# Altium project pIRfusiX_sensorBoard.PrjPcb
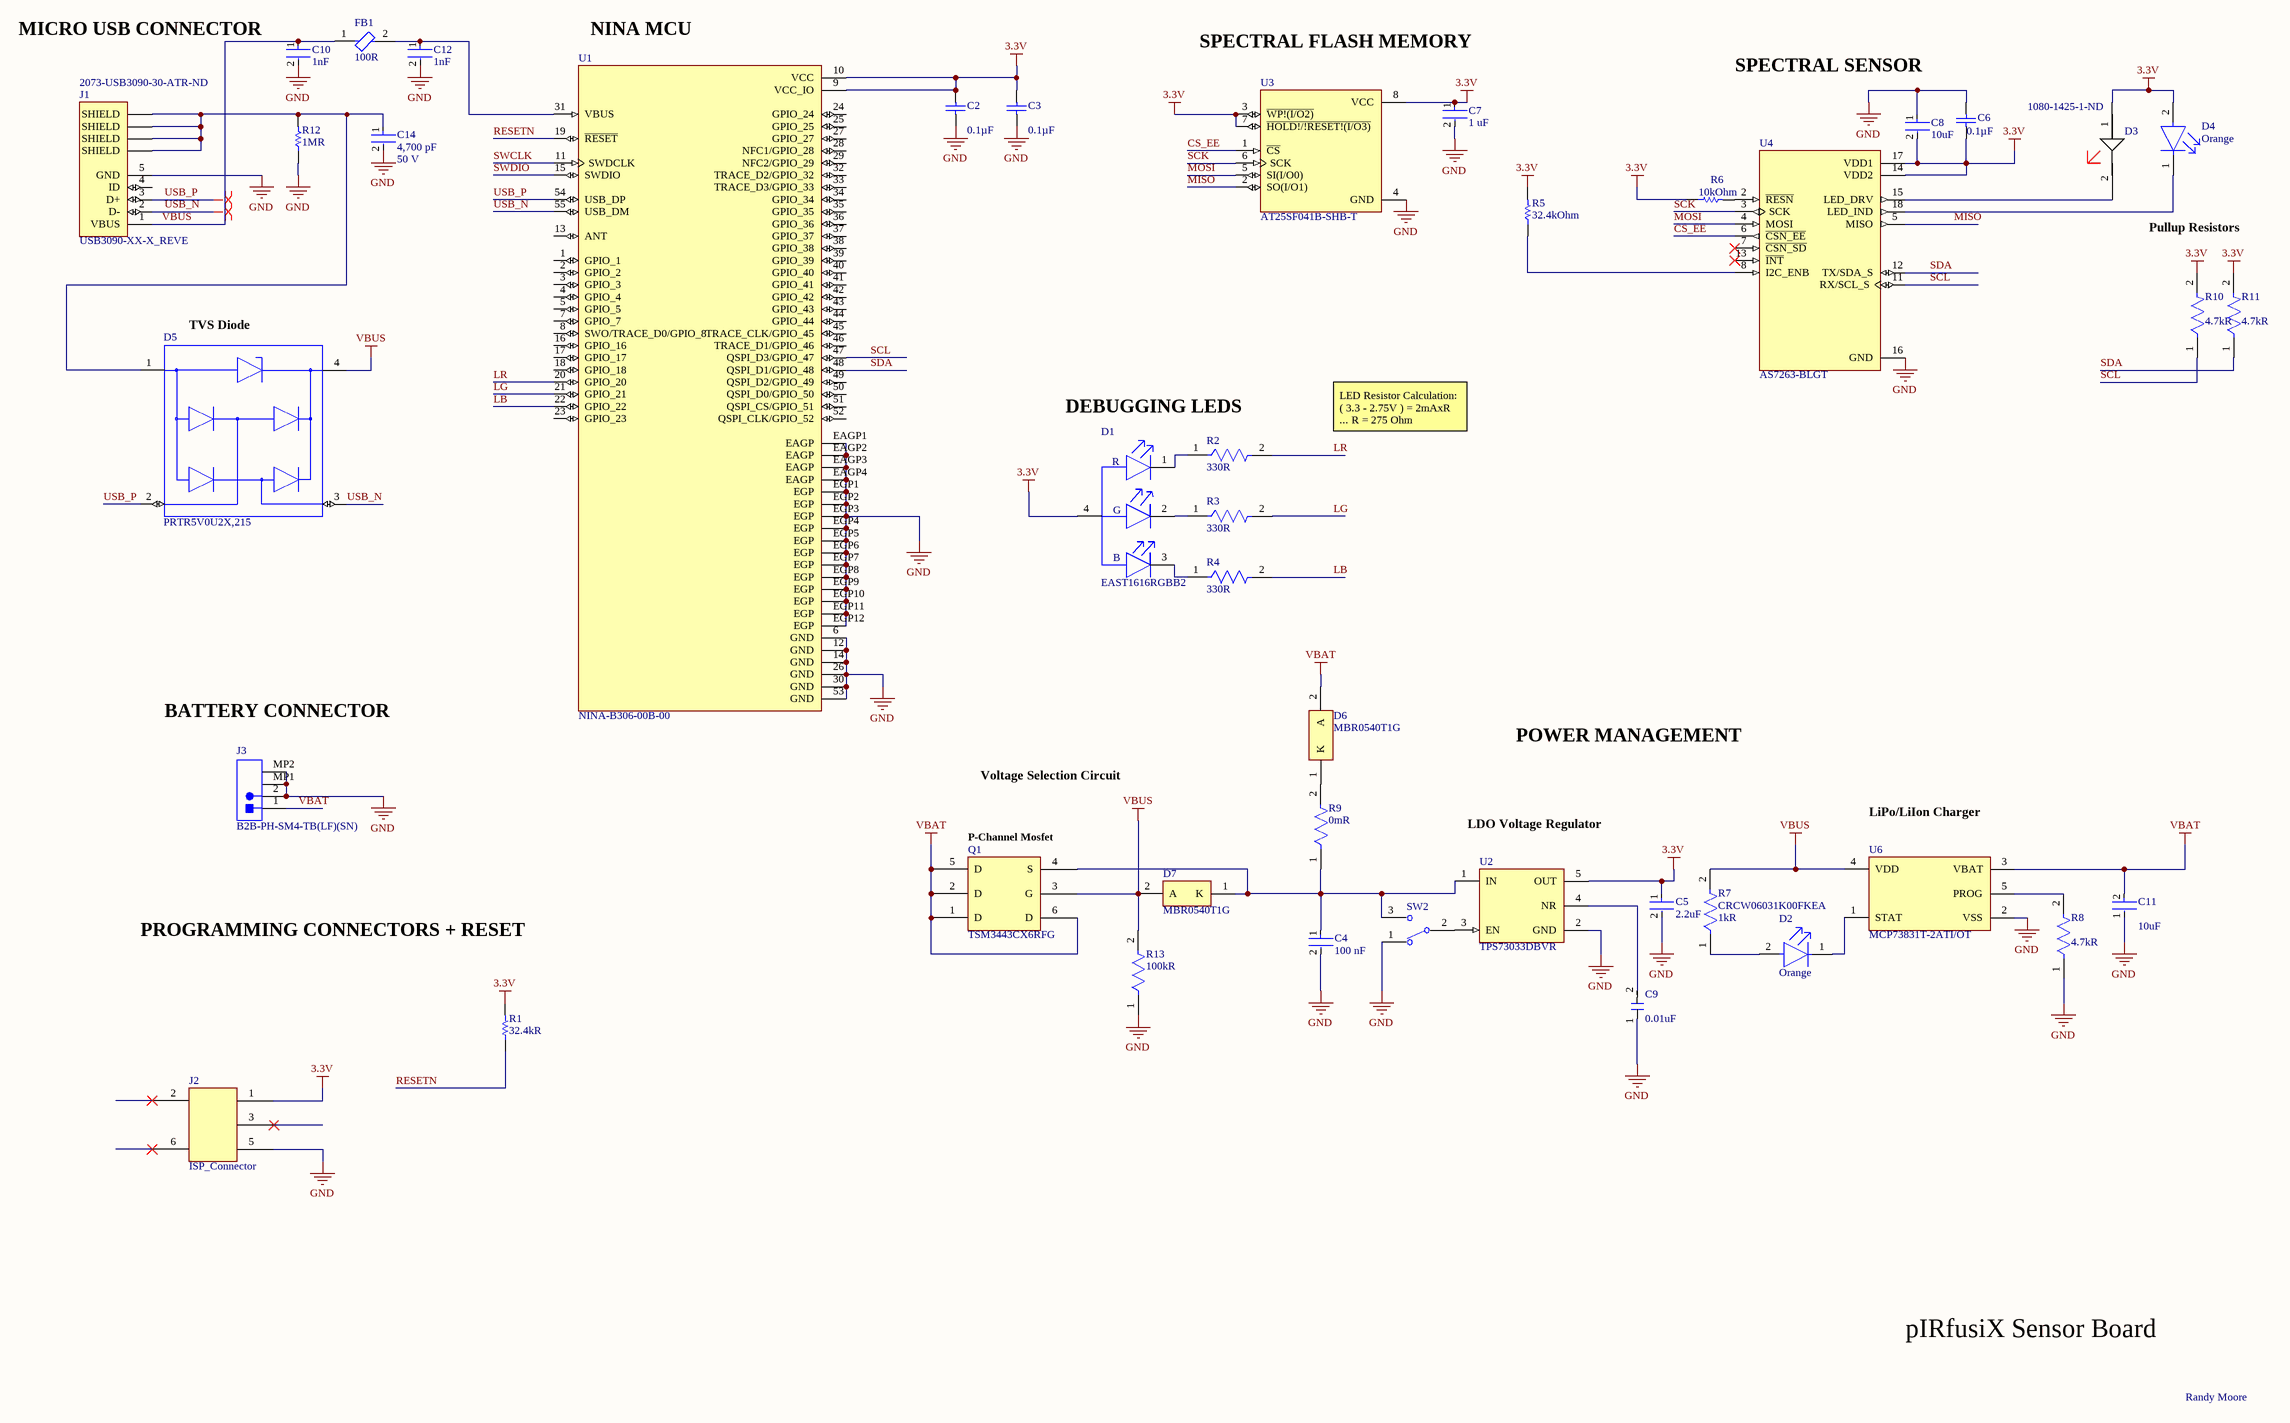
[diagram p0: SensorBoardSchm.SchDoc]
1 sheet, 43 parts. Net scope: global (net labels, ports and power ports of the same name join across sheets).
Board file: SensorBoard_PCB.PcbDoc

## Sheet SensorBoardSchm.SchDoc
size C

### Parts
C2  Capacitance: 0.1µF  [SAMS-C0603-2_M]  (hidden comment: CL10B104KB8NNNC)
C3  Capacitance: 0.1µF  [SAMS-C0603-2_M]  (hidden comment: CL10B104KB8NNNC)
C4  Capacitance: 100 nF  [FP-CC0603-DA-MFG]  (hidden comment: CC0603KRX7R7BB104)
C5  Capacitance: 2.2uF  [FP-GRM188-0_1-e0_2_0_5-MFG]  (hidden comment: GRM188R71A225KE15D)
C6  Capacitance: 0.1µF  [SAMS-C0603-2_M]  (hidden comment: CL10B104KB8NNNC)
C7  Capacitance: 1 uF  [FP-CC0603-DA-MFG]  (hidden comment: CC0603KPX7R7BB105)
C8  Capacitance: 10uF  [FP-GRM188-0_1-e0_2_0_55-IPC_A]  (hidden comment: GRM188R60J106ME47D)
C9  Capacitance: 0.01uF  [RESC1608X55N]  (hidden comment: C0603C103K3RACTU)
C10  Capacitance: 1nF  [FP-GRM188-0_1-e0_2_0_5-IPC_C]  (hidden comment: GRM1885C1H102JA01D)
C11  Capacitance: 10uF  [FP-C1608-080-0_1-MFG]  (hidden comment: C1608X5R0J106M080AB)
C12  Capacitance: 1nF  [FP-GRM188-0_1-e0_2_0_5-IPC_C]  (hidden comment: GRM1885C1H102JA01D)
C14  value 4,700 pF  Voltage Rating: 50 V  [FP-C0603C-CF-MFG]  (hidden comment: C0603C472J5GACTU)
D1  EAST1616RGBB2  [FP-EAST1616RGBB2-MFG]
D2  Colour: Orange  [FP-6_541-5056_01-4-MFG]  (hidden comment: TLMO1000-GS08)
D3  Supplier Part Number 1: 1080-1425-1-ND  [SIR19-21C/TR8]  (hidden comment: SIR19-21C/TR8)
D4  Colour: Orange  [FP-6_541-5056_01-4-MFG]  (hidden comment: TLMO1000-GS08)
D5  PRTR5V0U2X,215  [FP-SOT143B-MFG]
D6  MBR0540T1G  [ONSC-SOD-123-2-425-04_V]
D7  MBR0540T1G  [ONSC-SOD-123-2-425-04_V]
FB1  Impedance: 100R  [FP-BLM18-0_15-t0_5-MFG]  (hidden comment: BLM18EG101TN1D)
J1  USB3090-XX-X_REVE  Supplier Part Number 1: 2073-USB3090-30-ATR-ND  [GCT_USB3090-XX-X_REVE]
J2  ISP_Connector  [JST Programmer]
J3  B2B-PH-SM4-TB(LF)(SN)  [JST-B2B-PH-SM4-TB-2_V]
Q1  TSM3443CX6RFG  [SOT95P280X145-6N]
R1  Resistance: 32.4kR  [RESC1608X55X30ML15T15]  (hidden comment: ERJ-3EKF3242V)
R2  Resistance: 330R  [FP-CRCW0603-e3-MFG]  (hidden comment: CRCW0603330RFKEA)
R3  Resistance: 330R  [FP-CRCW0603-e3-MFG]  (hidden comment: CRCW0603330RFKEA)
R4  Resistance: 330R  [FP-CRCW0603-e3-MFG]  (hidden comment: CRCW0603330RFKEA)
R5  Resistance: 32.4kOhm  [RESC1608X55X30ML15T15]  (hidden comment: ERJ-3EKF3242V)
R6  Resistance: 10kOhm  [RESC1609X50X30ML10T20]  (hidden comment: CRCW060310K0FKTB)
R7  CRCW06031K00FKEA  Resistance: 1kR  [FP-CRCW0603-e3-MFG]
R8  Resistance: 4.7kR  [FP-CR0603-IPC_B]  (hidden comment: CR0603-FX-4701ELF)
R9  Resistance: 0mR  [FP-CRCW0603-HPe3-MFG]  (hidden comment: CRCW06030000Z0EAHP)
R10  Resistance: 4.7kR  [FP-CR0603-IPC_B]  (hidden comment: CR0603-FX-4701ELF)
R11  Resistance: 4.7kR  [FP-CR0603-IPC_B]  (hidden comment: CR0603-FX-4701ELF)
R12  Resistance: 1MR  [RESC1608X55X25LL10T15]  (hidden comment: RC0603FR-071ML)
R13  Resistance: 100kR  [FP-RC0603-0_55-MFG]  (hidden comment: RC0603FR-07100KL)
SW2  JS102011JAQN  [FP-JS102011JAQN-MFG]  (value not drawn)
U1  NINA-B306-00B-00  [XCVR_NINA-B306-00B-00]
U2  TPS73033DBVR  [FP-DBV0005A-MFG]
U3  AT25SF041B-SHB-T  [SOIC127P790X216-8N]
U4  AS7263-BLGT  [AS7263Footprint]
U6  MCP73831T-2ATI/OT  [FP-C04-091-OT-IPC_C]

### Nets
3.3V: C2.2 C3.2 C5.1 C6.1 C7.1 C8.2 D1.4(Common_Anode) D3.1 D4.2(A) J2.1(VDD) R1.2 R5.2 R6.1 R10.2 R11.2 U1.9(VCC_IO) U1.10(VCC) U2.5(OUT) U3.3(~{WP!(I/O2)}) U3.7(~{HOLD!/!RESET!(I/O3)}) U3.8(VCC) U4.14(VDD2) U4.17(VDD1)
GND: C2.1 C3.1 C4.2 C5.2 C6.2 C7.2 C8.1 C9.1 C10.2 C11.1 C12.2 C14.2 J1.5(GND) J2.5(GND) J3.2 J3.MP1 J3.MP2 R8.1 R12.1 R13.1 SW2.1 U1.6(GND) U1.12(GND) U1.14(GND) U1.26(GND) U1.30(GND) U1.53(GND) U1.EAGP1(EAGP) U1.EAGP2(EAGP) U1.EAGP3(EAGP) U1.EAGP4(EAGP) U1.EGP1(EGP) U1.EGP2(EGP) U1.EGP3(EGP) U1.EGP4(EGP) U1.EGP5(EGP) U1.EGP6(EGP) U1.EGP7(EGP) U1.EGP8(EGP) U1.EGP9(EGP) U1.EGP10(EGP) U1.EGP11(EGP) U1.EGP12(EGP) U2.2(GND) U3.4(GND) U4.16(GND) U6.2(VSS)
VBAT: C11.2 D6.2(A) J3.1 Q1.1(D) Q1.2(D) Q1.5(D) Q1.6(D) U6.3(VBAT)
VBUS: C10.1 D5.4(VCC) D7.2(A) FB1.1 J1.1(VBUS) Q1.3(G) R7.2 R13.2 U6.4(VDD)
CS_EE: U3.1(~{CS}) U4.6(~{CSN_EE})
LB: R4.2 U1.22(GPIO_22)
LG: R3.2 U1.21(GPIO_21)
LR: R2.2 U1.20(GPIO_20)
MISO: U3.2(SO(I/O1)) U4.5(MISO)
MOSI: U3.5(SI(I/O0)) U4.4(MOSI)
RESETN: R1.1 U1.19(~{RESET})
SCK: U3.6(SCK) U4.3(SCK)
SCL: R10.1 U1.47(QSPI_D3/GPIO_47) U4.11(RX/SCL_S)
SDA: R11.1 U1.48(QSPI_D1/GPIO_48) U4.12(TX/SDA_S)
SWCLK: U1.11(SWDCLK)
SWDIO: U1.15(SWDIO)
USB_N: D5.3(I/O_2) J1.2(D-) U1.55(USB_DM)
USB_P: D5.2(I/O_1) J1.3(D+) U1.54(USB_DP)
NetC4_1: C4.1 D7.1(K) Q1.4(S) R9.1 SW2.3 U2.1(IN)
NetC9_2: C9.2 U2.4(NR)
NetC12_1: C12.1 FB1.2 U1.31(VBUS)
NetC14_1: C14.1 D5.1(GND) J1.6(SHIELD) J1.7(SHIELD) J1.8(SHIELD) J1.9(SHIELD) R12.2
NetD1_1: D1.1(Red_C) R2.1
NetD1_2: D1.2(Green_C) R3.1
NetD1_3: D1.3(Blue_C) R4.1
NetD2_1: D2.1(C) U6.1(STAT)
NetD2_2: D2.2(A) R7.1
NetD3_2: D3.2 U4.15(LED_DRV)
NetD4_1: D4.1(C) U4.18(LED_IND)
NetD6_1: D6.1(K) R9.2
NetR5_1: R5.1 U4.8(I2C_ENB)
NetR6_2: R6.2 U4.2(~{RESN})
NetR8_2: R8.2 U6.5(PROG)
NetSW2_2: SW2.2(C) U2.3(EN)

Not connected (* = marked no-connect by the designer): J1 4(ID); J2 2(SWDIO)* 3(SWCLK)* 6(RESETN)*; U1 1(GPIO_1) 2(GPIO_2) 3(GPIO_3) 4(GPIO_4) 5(GPIO_5) 7(GPIO_7) 8(SWO/TRACE_D0/GPIO_8) 13(ANT) 16(GPIO_16) 17(GPIO_17) 18(GPIO_18) 23(GPIO_23) 24(GPIO_24) 25(GPIO_25) 27(GPIO_27) 28(NFC1/GPIO_28) 29(NFC2/GPIO_29) 32(TRACE_D2/GPIO_32) 33(TRACE_D3/GPIO_33) 34(GPIO_34) 35(GPIO_35) 36(GPIO_36) 37(GPIO_37) 38(GPIO_38) 39(GPIO_39) 40(GPIO_40) 41(GPIO_41) 42(GPIO_42) 43(GPIO_43) 44(GPIO_44) 45(TRACE_CLK/GPIO_45) 46(TRACE_D1/GPIO_46) 49(QSPI_D2/GPIO_49) 50(QSPI_D0/GPIO_50) 51(QSPI_CS/GPIO_51) 52(QSPI_CLK/GPIO_52); U4 7(~{CSN_SD})* 13(~{INT})*

### Layout directives
differential pair: USB_N, USB_P

### Notes on the sheet
- MICRO USB CONNECTOR
- (near U1) NINA MCU
- SPECTRAL FLASH MEMORY
- SPECTRAL SENSOR
- Pullup Resistors
- (near D5) TVS Diode
- DEBUGGING LEDS
- LED Resistor Calculation: ( 3.3 - 2.75V ) = 2mAxR ... R = 275 Ohm
- BATTERY CONNECTOR
- Voltage Selection Circuit
- POWER MANAGEMENT
- (near Q1) P-Channel Mosfet
- LDO Voltage Regulator
- LiPo/LiIon Charger
- PROGRAMMING CONNECTORS + RESET
- STAT = LOW when charging
  STAT = Z when restart mode
  STAT = HIGH when charged
  PROG sets the charge current
- pIRfusiX Sensor Board
- Randy Moore
- (in symbol CMP-51564-000002-1) R; G; B

### Library data of the parts
C2 C3 C6 = CMP-2000-05332-1: Multi-layer Ceramic Capacitor, -55 to 125 degC, 2-Pin SMD (0603), RoHS, Tape and Reel; Manufacturer: Samsung Electro-Mechanics; Rated Voltage: 50V; Dielectric: X7R; Tolerance (%): ±10%; Case Size/Dimension: 0603; Datasheet URL: https://datasheet.ciiva.com/29198/456651-da-01-en-vs-kondensator-0605-29198839.pdf; Manufacturer URL: http://www.samsungsem.com/global/index.jsp; Datasheet Version: Nov-10
C4 = CMP-2000-05002-2: CAP CER 0.1UF 16V X7R 0603; Manufacturer: YAGEO; Tolerance: 0.1; Value: 100 nF; Temperature Coefficient: 15%; Material: Ceramic; Voltage Rating: 16 V; Package: CC0603-DA; ComponentLink2Description: Datasheet; Octopart: https://octopart.com/cc0603krx7r7bb104-yageo-192941; Temperature Range High: +125°C; Digikey Description: CAP CER 0.1UF 16V X7R 0603; Voltage: 16 V; Device Class L2: Capacitors; Height: 0.9mm; Temperature: -55°C to +125°C; Manufacturer Part Number: CC0603KRX7R7BB104; Device Class L1: Passive Components; Device Class L3: Ceramic Capacitors; ComponentLink2URL: http://www.yageo.com/documents/recent/UPY-GPHC_X7R_6.3V-to-50V_18.pdf; Footprint Url: http://www.yageo.com/exep/pages/download/literatures/UPY-C_GEN_24.pdf; RoHS: TRUE; Temperature Range Low: -55°C; Temperature Characteristic: X7R; Lead Free: Yes; Category: Cap; Mouser Description: Multilayer Ceramic Capacitor, CC Series, 0.1 - F, - 10%, X7R, 16 V, 0603 [1608 Metric]; Automotive: No
C5 = CMP-2006-02836-2: Chip Multilayer Ceramic Capacitors for General Purpose, 0603, 2.2uF, X7R, 15%, 10%, 10V; Case Code (Metric): 1608; Height: 0.8mm; Packaging: Cut Tape; Voltage: 10V; Lead Free: Lead Free; Min Operating Temperature: -55°C; Voltage Rating (DC): 10V; Max Operating Temperature: 125°C; Voltage Rating: 10V; Dielectric: X7R; Depth: 0.8mm; Case Code (Imperial): 0603; Termination: SMD/SMT; Case/Package: 0603; Number of Pins: 2; REACH SVHC: No SVHC; Mount: Surface Mount; Width: 0.031inch; Material: Ceramic; Package Quantity: 1; Weight: 7.1E-05oz; Length: 1.6mm; Thickness: 0.035inch; Tolerance: 10%
C7 = CMP-03422-001047-1: CC0603 1 uF X7R 10.00% 16 V; Manufacturer: YAGEO; Temperature Coefficient: 15%; Tolerance: 0.1; Voltage Rating: 16 V; Material: Ceramic; Value: 1 uF; Device Class L3: Ceramic Capacitors; Temperature Characteristic: X7R; Device Class L2: Capacitors; Temperature Range Low: -55°C; Footprint Url: http://www.yageo.com/exep/pages/download/literatures/UPY-C_GEN_24.pdf; Device Class L1: Passive Components; Temperature: -55°C to +125°C; RoHS: TRUE; ComponentLink2URL: http://www.yageo.com/documents/recent/UPY-GPHC_X7R_6.3V-to-50V_18.pdf; Mouser Description: Cap Ceramic 1uF 16V X7R 10% SMD 0603 125°C Paper T/R; Octopart: https://octopart.com/cc0603kpx7r7bb105-yageo-25629533; Automotive: No; Height: 0.9mm; Voltage: 16 V; Lead Free: Yes; Category: Cap; Package: CC0603-DA; Temperature Range High: +125°C; Manufacturer Part Number: CC0603KPX7R7BB105; ComponentLink2Description: Datasheet
C8 = CMP-2006-02792-2: Chip Multilayer Ceramic Capacitors for General Purpose, 0603, 10uF, X5R, 15%, 20%, 6.3V; Packaging: Tape and Reel; Voltage Rating (DC): 6.3V; Width: 0.031inch; Termination: SMD/SMT; Dielectric: X5R; Package Quantity: 4000; Voltage Rating: 6.3V; Case/Package: 0603; Min Operating Temperature: -55°C; Voltage: 6.3V; Length: 1.6mm; Thickness: 0.035inch; Lead Free: Lead Free; Depth: 0.8mm; Case Code (Imperial): 0603; Max Operating Temperature: 85°C; Material: Ceramic; Height: 0.8mm; Tolerance: 20%; Mount: Surface Mount; REACH SVHC: No SVHC; Radiation Hardening: No; Case Code (Metric): 1608
C10 C12 = CMP-1662-00022-2: Chip Multilayer Ceramic Capacitors for General Purpose, 0603, 1000pF, C0G, 30ppm/°C, 5%, 50V; Insulation Resistance: 10GR; Number of Pins: 2; REACH SVHC: No SVHC; Width: 0.8mm; Tolerance: 5%; Termination: SMD/SMT; Thickness: 0.035inch; Height: 0.8mm; Case Code (Imperial): 0603; Length: 1.6mm; Voltage Rating: 50V; Voltage Rating (DC): 50V; Temperature Coefficient: 30ppm/°C; Mount: Surface Mount; Lead Free: Lead Free; Max Operating Temperature: 125°C; Min Operating Temperature: -55°C; Packaging: Tape and Reel; Dielectric: C0G; Voltage: 50V; Package Quantity: 1; Material: Ceramic; Case Code (Metric): 1608; Radiation Hardening: No; Depth: 0.8mm; Case/Package: 0603; Dielectric Material: Ceramic
C11 = CMP-2000-04978-2: Multilayer Ceramic Capacitors 10μF ±20% 6.3V X5R SMD 0603; Min Operating Temperature: -55°C; Construction: Flat; Width: 0.031inch; Weight: 7.1E-05oz; Voltage Rating: 6.3V; Length: 1.6mm; Voltage: 6.3V; Resistor Type: Ceramic; Mount: Surface Mount; RoHS Compliant: Yes; Packaging: Tape and Reel; Voltage Rating (DC): 6.3V; Case Code (Metric): 1608; Radiation Hardening: No; Dielectric Material: Ceramic; Lead Free: Lead Free; Case Code (Imperial): 0603; Dielectric: X5R; Termination: SMD/SMT; Depth: 0.8mm; Series: C; REACH SVHC: No SVHC; Package Quantity: 1; Thickness: 0.035inch; Height: 0.8mm; Max Operating Temperature: 85°C; Case/Package: 0603; Tolerance: 20%
C14 = CMP-2006-03333-2: CAP CER 4700PF 50V 5% NP0 0603; Manufacturer: KEMET; Automotive Grade: Grade 1; Temperature Coefficient: 30ppm/°C; Tolerance: 0.05; Temperature Characteristic: C0G; Material: Ceramic; RoHS: TRUE; Device Class L1: Passive Components; Category: Cap; Device Class L3: Ceramic Capacitors; Height: 0.87mm; Temperature: -55°C to +125°C; Octopart: https://octopart.com/c0603c472j5gactu-kemet-9145067; Automotive: Yes; Mouser Description: Multilayer Ceramic Capacitors MLCC - SMD/SMT 50volts 4700pF 5% C0G; Temperature Range High: +125°C; Lead Free: Yes; Capacitance: 4,700 pF; Manufacturer Part Number: C0603C472J5GACTU; Device Class L2: Capacitors; ComponentLink2Description: Datasheet; Digikey Description: CAP CER 4700PF 50V 5% NP0 0603; Package: C0603C-CF; ComponentLink2URL: https://api.kemet.com/component-edge/download/datasheet/C0603C100J5GACAUTO.pdf; Temperature Range Low: -55°C
D1 = CMP-51564-000002-1: LED RGB DIFFUSED 4SMD; Manufacturer: Everlight; Viewing Angle: 120°; Power Dissipation: 95/95/60mW; Luminous Intensity: 36/140/45mcd; Colour: Blue, Green, Red; Peak Emmision Wavelength: 468/518/632nm; Forward Current: 5mA; Reverse Voltage: 5V; Led Orientation: Top View; Forward Voltage: 3/3/2.1V; Wavelength: 475/535/628nm; Temperature: -40°C to +85°C; Temperature Range Low: -40°C; ComponentLink2URL: https://everlightamericas.com/index.php?controller=attachment&id_attachment=2426; ComponentLink2Description: Datasheet; Category: Diode; Digikey Description: LED RGB DIFFUSED 4SMD; Automotive: No; RoHS: TRUE; Manufacturer Part Number: EAST1616RGBB2; Device Class L2: LEDs; Device Class L1: Optoelectronics; Octopart: https://octopart.com/east1616rgbb2-everlight-80328051; Device Class L3: unset; Package: 0; Temperature Range High: +85°C; Lead Free: Yes; Height: 0.45mm
D2 D4 = CMP-02520-000010-1: LED ORANGE 0603 SMD; Manufacturer: Vishay; Automotive Grade: Grade 2; Luminous Intensity: 7.5mcd; Forward Current: 2mA; Forward Voltage: 1.8V; Led Orientation: Top View; Power Dissipation: 40mW; Max Junction Temp: +120°C; Wavelength: 605nm; Viewing Angle: 160°; Peak Emmision Wavelength: 610nm; Reverse Voltage: 6V; Digikey Description: LED ORANGE 0603 SMD; Lead Free: Yes; RoHS: TRUE; Device Class L1: Optoelectronics; Automotive: Yes; Manufacturer Part Number: TLMO1000-GS08; Category: Diode; Device Class L3: unset; Temperature Range Low: -40°C; Temperature Range High: +100°C; Ambient Temperature Range High: +100°C; ComponentLink2URL: http://www.vishay.com/docs/83172/tlmo1000.pdf; Height: 0.65mm; Ambient Temperature Range Low: -40°C; Device Class L2: LEDs; Octopart: https://octopart.com/tlmo1000-gs08-vishay-41955669; Temperature: -40°C to +100°C; ComponentLink2Description: Datasheet; Package: 6.541-5056.01-4
D5 = CMP-14436-000007-1: TVS DIODE 5.5V SOT143B
D6 D7 = CMP-1055-00401-1: Schottky Power Rectifier, 2-Pin SOD-123, Pb-Free, Tape and Reel; Manufacturer: On Semiconductor; IFSM Max (A): 5.5; Configuration: Single; ComponentLink1URL: http://www.onsemi.com/; ComponentLink3Description: Package Specification; RoHS: TRUE; PackageVersion: Rev. G, 10/2009; DatasheetVersion: Rev. 7; ComponentLink3URL: http://www.onsemi.com/pub_link/Collateral/425-04.PDF; Packing: Tape and Reel; ComponentLink1Description: Manufacturer URL; PackageDescription: 2-Pin SOD, Body 1.6 x 2.69 mm; PartNumber: MBR0540T1G; ComponentLink2Description: Datasheet; ComponentLink2URL: http://www.onsemi.cn/pub_link/Collateral/MBR0540T1-D.PDF; PackageReference: SOD-123-2-425-04; Mounting Technology: Surface Mount
FB1 = CMP-0686-00530-3: Chip Ferrite Bead, 0603, 100Ω @ 100MHz, 25%, 0.045Ω, 2A; DC Resistance (DCR): 45mR; Number of Circuits: 1; Max Current Rating: 2A; Depth: 0.8mm; Case Code (Imperial): 0603; Tolerance: 25%; Packaging: Tape and Reel; Core Material: Ferrite; Material: Ferrite; Termination: SMD/SMT; Case Code (Metric): 1608; Package Quantity: 1; Length: 1.6mm; Contact Plating: Tin; Lead Free: Lead Free; Max Operating Temperature: 125°C; Height: 0.8mm; Current Rating: 2A; REACH SVHC: No SVHC; Max DC Current: 2A; Min Operating Temperature: -55°C; Case/Package: 0603; Number of Pins: 2; Width: 0.8mm; Test Frequency: 100MHz; Number of Lines: 1
J1 = USB3090-XX-X_REVE: USB - micro AB USB 2.0 Receptacle Connector 5 Position Surface Mount, Right Angle; Through Hole; MP: USB3090-30-A; MF: Global Connector Technology; SnapEDA_Link: https://www.snapeda.com/parts/USB3090-30-A/Global%20Connector%20Technology/view-part/281875/?ref=snap; Price: None; Availability: Unavailable; Value: *; Package: None; Supplier 1: Digi-Key
J3 = CMP-2000-05163-1: Male Header, Pitch 2 mm, 1 x 2 Position, Height 6.6 mm, RoHS, Tape and Reel; Manufacturer: JST; No of Positions: 2; Style/Orientation: StraightHeader/Plug; Pitch: 2mm; Datasheet URL: https://ciiva.com/datasheet-click-26894756?src=ciiva&sig=90099765; Termination: Crimp; Manufacturer URL: http://www.jst.com/home2.html; Type: ShroudedHeader; Datasheet Version: Dec-12
R1 R5 = CMP-2000-00433-1: Manufacturer: Panasonic; Part Number: ERJ-3EKF3242V
R2-R4 = CMP-1012-00454-3: RES Thick Film, 330Ω, 1%, 0.1W, 100ppm/°C, 0603; Voltage Rating: 75V; Max Power Dissipation: 100mW; Depth: 0.85mm; Contact Plating: Tin; Package Quantity: 10; Termination: SMD/SMT; Tolerance: 1%; Height: 0.45mm; Number of Terminations: 2; Radiation Hardening: No; Features: Automotive AEC-Q200; Case/Package: 0603; Mount: Surface Mount; Case Code (Metric): 1608; Lead Free: Lead Free; Temperature Coefficient: 100ppm/°C; Weight: 7.1E-05oz; Military Standard: Not; Packaging: Tape and Reel; Max Operating Temperature: 155°C; Voltage Rating (DC): 75V; Length: 1.55mm; Min Operating Temperature: -55°C; Composition: Thick Film; Case Code (Imperial): 0603; Width: 0.033inch; Power Rating: 100mW
R6 = CMP-2000-03837-1: Manufacturer: Vishay Dale; Part Number: CRCW060310K0FKTB
R7 = CMP-1666-00003-5: RES Thick Film, 1kΩ, 1%, 0.1W, 100ppm/°C, 0603; Max Power Dissipation: 100mW; Voltage Rating: 75V; Max Operating Temperature: 155°C; Number of Pins: 2; Case Code (Imperial): 0603; Width: 0.033inch; Power Rating: 100mW; Number of Terminations: 2; Package Quantity: 10; Weight: 7.1E-05oz; Tolerance: 1%; Temperature Coefficient: 100ppm/°C; Military Standard: Not; Mount: Surface Mount; Voltage Rating (DC): 75V; Depth: 0.85mm; Composition: Thick Film; Radiation Hardening: No; Termination: SMD/SMT; Length: 1.55mm; Case Code (Metric): 1608; Contact Plating: Tin; Min Operating Temperature: -55°C; Packaging: Tape and Reel; Height: 0.45mm; Lead Free: Lead Free; Case/Package: 0603; Features: Automotive AEC-Q200
R8 R10 R11 = CMP-07231-003020-1: Thick Film Chip Resistors 0603 4.7kΩ 0.1W 1% 100ppm/°C; Voltage Rating (DC): 50V; Power Rating: 100mW; Case Code (Imperial): 0603; Thickness: 457um; Length: 1.6mm; Number of Pins: 2; Max Operating Temperature: 155°C; Termination: SMD/SMT; Min Operating Temperature: -55°C; Packaging: Tape and Reel; Composition: Thick Film; Radiation Hardening: No; Case/Package: 0603; Case Code (Metric): 1608; Height: 0.45mm; Voltage Rating: 50V; Mount: Surface Mount; Max Power Dissipation: 100mW; Contact Plating: Tin; REACH SVHC: No SVHC; Depth: 0.8mm; Package Quantity: 1; Tolerance: 1%; Temperature Coefficient: 100ppm/°C; Width: 0.8mm; Features: Moisture Resistant; Number of Terminations: 2
R9 = CMP-2000-03817-2: RES Thick Film, 0Ω, , 0.33W, , 0603; Max Power Dissipation: 250mW; Voltage Rating (DC): 75V; Temperature Coefficient: 0ppm/°C; Mount: Surface Mount; Package Quantity: 5000; Features: Automotive AEC-Q200; Length: 1.6mm; Width: 0.033inch; Min Operating Temperature: -55°C; Max Operating Temperature: 155°C; Contact Plating: Tin; Depth: 0.85mm; Case/Package: 0603; Radiation Hardening: No; Military Standard: Not; Power Rating: 250mW; Height: 0.45mm; Composition: Thick Film; Lead Free: Lead Free; Voltage Rating: 75V; Case Code (Imperial): 0603; Weight: 7.1E-05oz; Number of Terminations: 2; Packaging: Tape and Reel; Number of Pins: 2; Case Code (Metric): 1608; Termination: SMD/SMT
R12 = CMP-1659-00056-1: Chip Resistor, 1 MOhm, +/- 1%, 100 mW, -55 to 155 degC, 0603 (1608 Metric), RoHS, Tape and Reel; Voltage Rating (DC): 25 V; Tolerance: 20%; Case\Package: Radial; Capacitance: 1 mF; Min Operating Temperature: -40 degC; PackageDescription: 2-Pin Surface Mount Device, Body 1.6 x 0.8 mm; ComponentLink1Description: Manufacturer URL; Radiation Hardening: No; DatasheetVersion: Rev. 4, 02/2016; REACH SVHC: No SVHC; Length: 20 mm; Max Operating Temperature: 85 degC; Diameter: 10 mm; Packaging: Bulk; Package Quantity: 200; PackageReference: 0603; Mount: Through Hole; ComponentLink1URL: http://www.yageo.com/; ComponentLink2URL: http://www.yageo.com/documents/recent/PYu-RC_Group_51_RoHS_L_04.pdf; ComponentLink2Description: Datasheet; Width: 0 inch; Lead Pitch: 5 mm; RoHSCompliant: true; Voltage Rating: 25 V; Height: 20 mm
R13 = CMP-2100-03662-2: RES SMD 100K OHM 1% 1/10W 0603; Voltage Rating (DC): 50V; Max Power Dissipation: 100mW; Temperature Coefficient: 100ppm/°C; Working Voltage: 75V; Length: 1.6mm; Lead Free: Lead Free; Number of Terminations: 2; Packaging: Tape and Reel; Voltage Rating: 50V; Termination: SMD/SMT; Width: 0.8mm; Resistor Type: Thick Film; Resistance Tolerance: 1%; Features: Moisture Resistant; Height: 0.45mm; Construction: Rectangular; Case/Package: 0603; Military Standard: Not; Case Code (Imperial): 0603; Series: RC; Technology: THICK FILM; Depth: 0.8mm; RoHS Compliant: Yes; REACH SVHC: No SVHC; Min Operating Temperature: -55°C; Case Code (Metric): 1608; Max Operating Temperature: 155°C; Power Rating: 100mW; Number of Pins: 2; Tolerance: 1%
SW2 = CMP-10038-000001-1: SWITCH SLIDE SPDT 300MA 6V; Manufacturer: C&K; Contact Resistance: 70mΩ; Electromechanical Life: 5000Cycles; Device Class L2: Switches; Temperature Range Low: -40°C; Device Class L1: Electromechanical; RoHS: TRUE; Automotive: No; Throw Configuration: SPDT; Height: 3.5mm; Manufacturer Part Number: JS102011JAQN; Digikey Description: SWITCH SLIDE SPDT 300MA 6V; Device Class L3: Slide Switches; Temperature Range High: +85°C; Mouser Description: JS Series Sub-Miniature Slide Switch SPDT Right-Angle SMT; Mount: Surface Mount; ComponentLink2Description: Datasheet; Octopart: https://octopart.com/js102011jaqn-c%26k+components-74831566; Category: Switch; Contact Current Rating: 300mA; Temperature: -40°C to +85°C; Voltage Rating Dc: 6V; ComponentLink2URL: https://www.ckswitches.com/media/1422/js.pdf; Lead Free: Yes; Package: JS102011JAQN
U1 = NINA-B306-00B-00: With internal PCB antenna, 10.0 x 15.0 x 2.2 mm, use with open CPU; MF: u-blox; Value: *; Package: SMD-55 u-blox; Price: None; MP: NINA-B306-00B-00; Availability: Unavailable; SnapEDA_Link: https://www.snapeda.com/parts/NINA-B306-00B-00/u-blox/view-part/4176731/?ref=snap
U2 = CMP-04917-000026-1: IC REG LINEAR 3.3V 200MA SOT23-5; Manufacturer: Texas Instruments; Max Supply Voltage: 5.5V; Dropout Voltage: 120mV; Nominal Supply Current: 170uA; Max Junction Temp: +125°C; Output Type: Fixed; Standoff Height: 0mm; Min Supply Voltage: 2.7V; Accuracy Percentage: 2%; Number Of Outputs: 1; Height: 1.45mm; Device Class L3: Voltage Regulators - Linear; Temperature: -40°C to +125°C; Lead Free: Yes; Octopart: https://octopart.com/tps73033dbvr-texas+instruments-525554; Manufacturer Part Number: TPS73033DBVR; RoHS: TRUE; Temperature Range High: +125°C; ComponentLink2Description: Datasheet; Device Class L2: Power Management ICs; Automotive: No; Mouser Description: IC REG LINEAR 3.3V 200MA SOT23-5; Temperature Range Low: -40°C; Device Class L1: Integrated Circuits (ICs); Output Voltage: 3.3V; Output Current: 200mA; Package: DBV0005A; ComponentLink2URL: http://www.ti.com/lit/ds/symlink/tps730.pdf; Digikey Description: IC REG LINEAR 3.3V 200MA SOT23-5; Category: IC
U3 = AT25SF041B-SHB-T: 4 Mbit, 3.0V (2.7V to 3.6V), -40C to 85C, SOIC-W 208mil (Tape & Reel), Single, Dual, Quad SPI NOR flash; MF: Dialog Semiconductor; MP: AT25SF041B-SHB-T; SnapEDA_Link: https://www.snapeda.com/parts/AT25SF041B-SHB-T/Dialog%20Semiconductor/view-part/5488498/?ref=snap; Price: None; Purchase-URL: https://pricing.snapeda.com/search/part/AT25SF041B-SHB-T/?ref=eda; Package: SOIC-8 Dialog Semiconductor; Availability: Warning; Check_prices: https://www.snapeda.com/parts/AT25SF041B-SHB-T/Dialog%20Semiconductor/view-part/5488498/?ref=eda; Value: *; Supplier 1: Digi-Key; Supplier Part Number 1: 1265-AT25SF041B-SHB-TCT-ND
U4 = AS7263-BLGT: Optical Sensor Ambient 610nm, 680nm, 730nm, 760nm, 810nm, 860nm IÂ²C, SPI 20-BFLGA; MF: ams; Package: LGA-20 ams; Availability: Unavailable; Value: *; MP: AS7263-BLGT; SnapEDA_Link: https://www.snapeda.com/parts/AS7263-BLGT/ams/view-part/1600359/?ref=snap; Price: None
U6 = CMP-0133-00144-2: IC CONTROLLR LI-ION 4.2V SOT23-5; Max Supply Voltage: 6V; Max Output Current: 500mA; Min Output Voltage: 4.168V; Max Output Voltage: 4.232V; Min Supply Voltage: 3.75V; Number of Cells: 1; Lead Free: Lead Free; Number of Pins: 5; Package Quantity: 3000; Min Operating Temperature: -40°C; Width: 1.8mm; Max Charge Current: 500mA; Output Current: 500mA; Packaging: Tape and Reel; Height: 1.3mm; Output Voltage: 4.2V; Max Operating Temperature: 85°C; Mount: Surface Mount; Case/Package: SOT-23; Length: 3.1mm; REACH SVHC: No SVHC
C9 = C0603C103K3RACTU: Supplier 1: Digi-Key; Supplier Part Number 1: 399-C0603C103K3RAC7867CT-ND
D3 = SIR19-21C/TR8: Supplier 1: Digi-Key
Q1 = TSM3443CX6RFG: Supplier 1: Digi-Key; Supplier Part Number 1: TSM3443CX6RFGCT-ND